# EAGLE design STUDENT V2 (EAGLE 8.2.2)

## Sheet 1 of 3
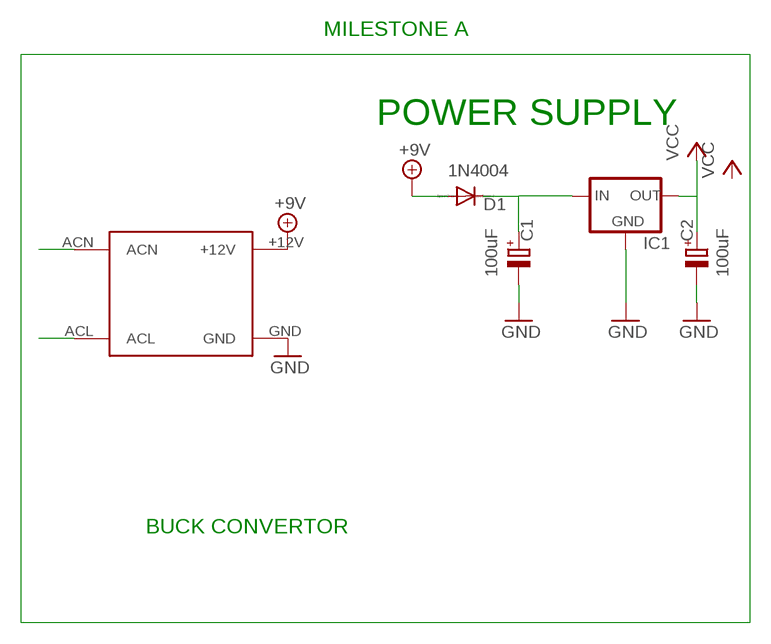
[diagram p0: schematic, sheet 1]

### Parts
C1  100uF  CPOL-EUE2.5-6  [E2,5-6]
C2  100uF  CPOL-EUE2.5-6  [E2,5-6]
D1  1N4004  [DO41-10]
IC1  78XXS  [78XXS]
U$2  12VMODULE12VMODULE  [12VMODULE]

### Nets
+9V: D1.A U$2.+12V ; also sheet 2
ACL: U$2.ACL ; also sheet 2
ACN: U$2.ACN ; also sheet 2
GND: C1.- C2.- IC1.GND U$2.GND ; also sheet 2,3
N$7: C1.+ D1.C IC1.IN
VCC: C2.+ IC1.OUT ; also sheet 2,3

### Notes on the sheet
- MILESTONE A
- POWER SUPPLY
- BUCK CONVERTOR

## Sheet 2 of 3
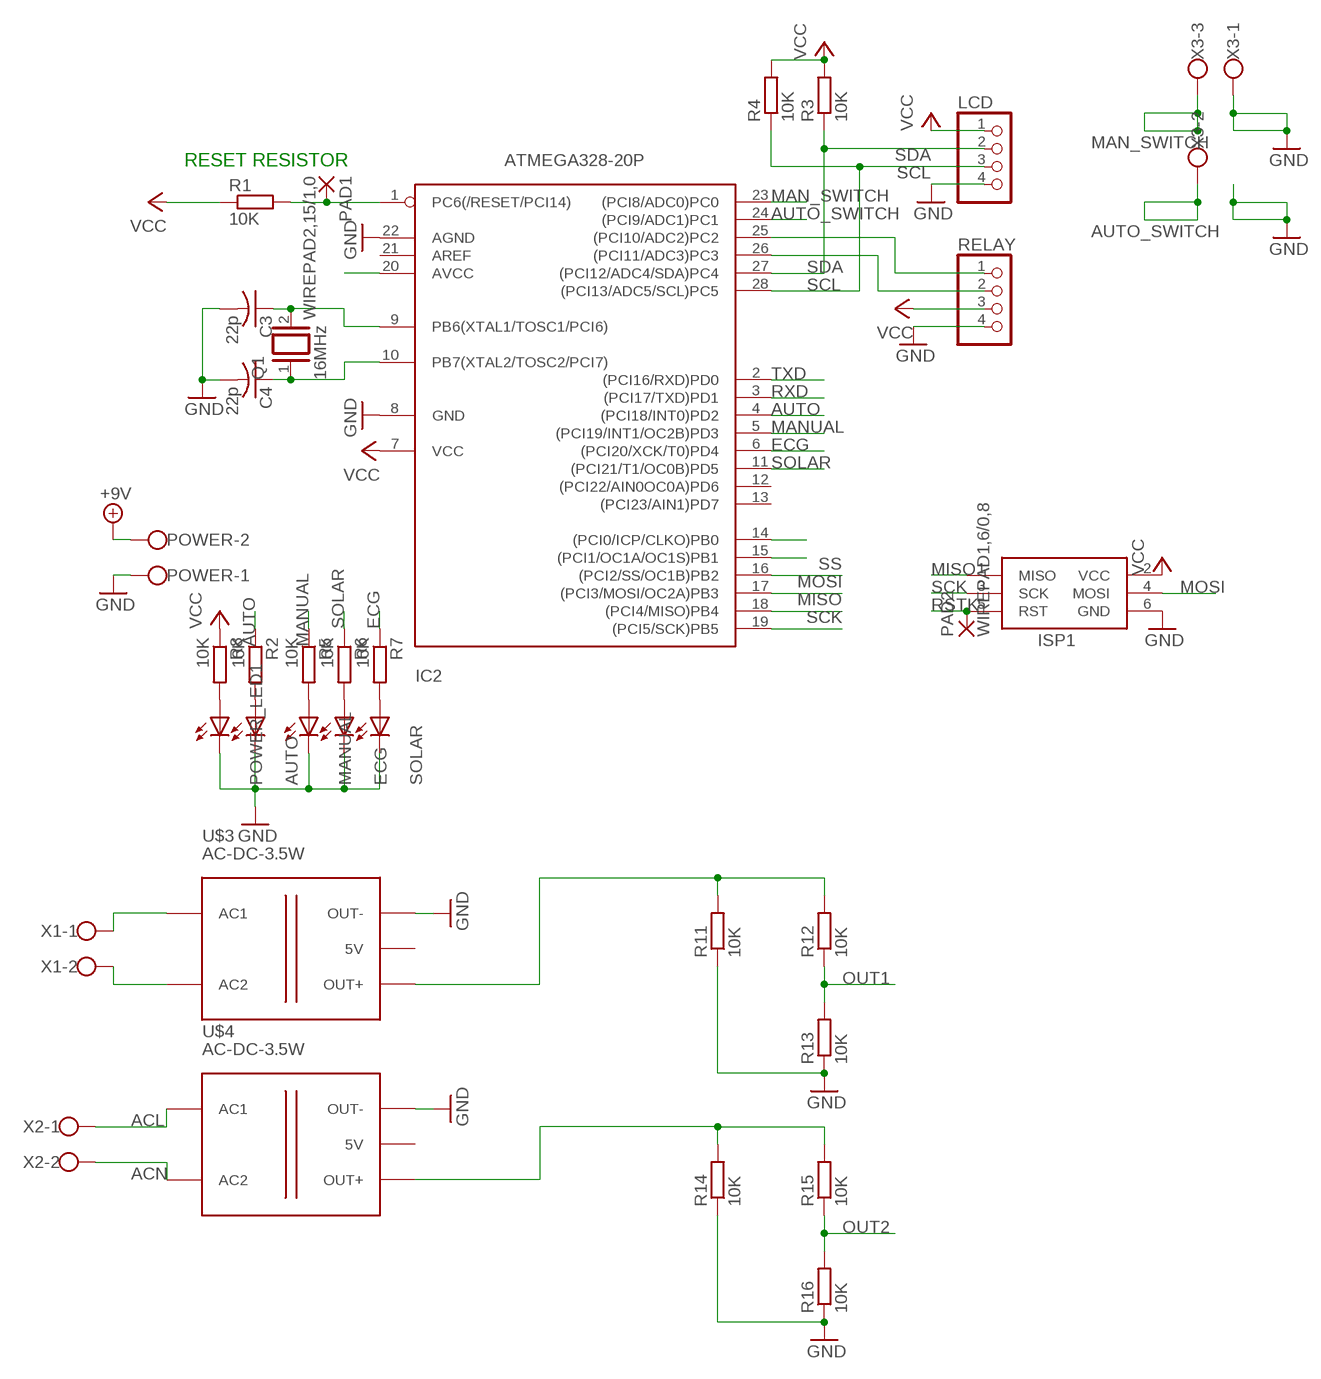
[diagram p1: schematic, sheet 2]

### Parts
AUTO  LED5MM  [LED5MM]
C3  22p  C-US025-024X044  [C025-024X044]
C4  22p  C-US025-024X044  [C025-024X044]
ECG  LED5MM  [LED5MM]
IC2  ATMEGA328-20P  [DIL28-3]
ISP1  AVRISP-6  [AVRISP]
LCD  PINHD-1X4  [1X04]
MANUAL  LED5MM  [LED5MM]
PAD1  WIREPAD2,15/1,0  [2,15/1,0]
PAD2  WIREPAD1,6/0,8  [1,6/0,8]
POWER  W237-102  [W237-102]
POWER_LED1  LED5MM  [LED5MM]
Q1  16MHz  XTAL/S  [QS]
R1  10K  R-EU_R2010  [R2010]
R2  10K  R-EU_R2010  [R2010]
R3  10K  R-EU_R2010  [R2010]
R4  10K  R-EU_R2010  [R2010]
R5  10K  R-EU_R2010  [R2010]
R6  10K  R-EU_R2010  [R2010]
R7  10K  R-EU_R2010  [R2010]
R8  10K  R-EU_R2010  [R2010]
R11  10K  R-EU_0207/12  [0207/12]
R12  10K  R-EU_0207/12  [0207/12]
R13  10K  R-EU_0207/12  [0207/12]
R14  10K  R-EU_0207/12  [0207/12]
R15  10K  R-EU_0207/12  [0207/12]
R16  10K  R-EU_0207/12  [0207/12]
RELAY  PINHD-1X4  [1X04]
SOLAR  LED5MM  [LED5MM]
U$3  AC-DC-3.5W  [AC-DC-3.5W]
U$4  AC-DC-3.5W  [AC-DC-3.5W]
X1  W237-102  [W237-102]
X2  W237-102  [W237-102]
X3  W237-103  [W237-103]

### Nets
+9V: POWER.2 ; also sheet 1
ACL: U$4.J1.1(AC1) X2.1 ; also sheet 1
ACN: U$4.J1.2(AC2) X2.2 ; also sheet 1
AUTO: IC2.4((PCI18/INT0)PD2) R2.1
AUTO_SWITCH: IC2.24((PCI9/ADC1)PC1) X3.2
ECG: IC2.6((PCI20/XCK/T0)PD4) R7.1
GND: AUTO.K(C) C3.2 C4.2 ECG.K(C) IC2.8(GND) IC2.22(AGND) ISP1.6(GND) LCD.4 MANUAL.K(C) POWER.1 POWER_LED1.K(C) R11.1 R13.1 R14.1 R16.1 RELAY.4 SOLAR.K(C) U$3.J2.1(OUT-) U$4.J2.1(OUT-) X3.1 ; also sheet 1,3
MAN_SWITCH: IC2.23((PCI8/ADC0)PC0) X3.3
MANUAL: IC2.5((PCI19/INT1/OC2B)PD3) R5.1
MISO: IC2.18((PCI4/MISO)PB4) ISP1.1(MISO)
MOSI: IC2.17((PCI3/MOSI/OC2A)PB3) ISP1.4(MOSI)
N$1: IC2.25((PCI10/ADC2)PC2) RELAY.1
N$2: POWER_LED1.A R8.2
N$4: C3.1 IC2.9(PB6(XTAL1/TOSC1/PCI6)) Q1.2
N$5: C4.1 IC2.10(PB7(XTAL2/TOSC2/PCI7)) Q1.1
N$6: AUTO.A R2.2
N$8: IC2.20(AVCC)
N$9: MANUAL.A R5.2
N$10: ECG.A R6.2
N$11: R7.2 SOLAR.A
N$12: R11.2 R12.2 U$3.J2.3(OUT+)
N$13: R14.2 R15.2 U$4.J2.3(OUT+)
N$14: U$3.J1.1(AC1) X1.1
N$15: U$3.J1.2(AC2) X1.2
N$18: IC2.26((PCI11/ADC3)PC3) RELAY.2
OUT1: IC2.14((PCI0/ICP/CLKO)PB0) R12.1 R13.2
OUT2: IC2.15((PCI1/OC1A/OC1S)PB1) R15.1 R16.2
RST: IC2.1(PC6(/RESET/PCI14)) PAD1.1(P) R1.2
RSTK: ISP1.5(RST) PAD2.1(P)
RXD: IC2.3((PCI17/TXD)PD1) ; also sheet 3
SCK: IC2.19((PCI5/SCK)PB5) ISP1.3(SCK)
SCL: IC2.28((PCI13/ADC5/SCL)PC5) LCD.3 R4.1
SDA: IC2.27((PCI12/ADC4/SDA)PC4) LCD.2 R3.1
SOLAR: IC2.11((PCI21/T1/OC0B)PD5) R6.1
SS: IC2.16((PCI2/SS/OC1B)PB2)
TXD: IC2.2((PCI16/RXD)PD0) ; also sheet 3
VCC: IC2.7(VCC) ISP1.2(VCC) LCD.1 R1.1 R3.2 R4.2 R8.1 RELAY.3 ; also sheet 1,3
Unconnected: IC2.12((PCI22/AIN0OC0A)PD6) IC2.13((PCI23/AIN1)PD7) IC2.21(AREF) U$3.J2.2(5V) U$4.J2.2(5V)

### Notes on the sheet
- RESET RESISTOR

## Sheet 3 of 3
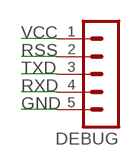
[diagram p2: schematic, sheet 3]

### Parts
DEBUG  MA05-1  [MA05-1]

### Nets
GND: DEBUG.5 ; also sheet 1,2
RSS: DEBUG.2
RXD: DEBUG.4 ; also sheet 2
TXD: DEBUG.3 ; also sheet 2
VCC: DEBUG.1 ; also sheet 1,2

## Library data of the parts
AUTO ECG MANUAL POWER_LED1 SOLAR = adafruit:LED: LED OSRAM: - CHIPLED LG R971, LG N971, LY N971, LG Q971, LY Q971, LO R971, LY R971 LH N974, LH R974 LS Q976, LO Q976, LY Q976 LO Q996 - Hyper CHIPLED LW Q18S LB Q993, LB Q99A, LB R99A - SideLED LS A670, LO A670, LY A670, LG A670, LP A670 LB A673, LV A673, LT A673, LW A673 LH A674 LY A675 LS A676, LA A676, LO A676, LY A676, LW A676 LS A679, LY A679, LG A679 - Hyper Micro SIDELED® LS Y876, LA Y876, LO Y876, LY Y876 LT Y87S - SmartLED LW L88C, LW L88S LB L89C, LB L89S, LG L890 LS L89K, LO L89K, LY L89K LS L896, LA L896, LO L896, LY L896 - TOPLED LS T670, LO T670, LY T670, LG T670, LP T670 LSG T670, LSP T670, LSY T670, LOP T670, LYG T670 LG T671, LOG T671, LSG T671 LB T673, LV T673, LT T673, LW T673 LH T674 LS T676, LA T676, LO T676, LY T676, LB T676, LH T676, LSB T676, LW T676 LB T67C, LV T67C, LT T67C, LS T67K, LO T67K, LY T67K, LW E67C LS E67B, LA E67B, LO E67B, LY E67B, LB E67C, LV E67C, LT E67C LW T67C LS T679, LY T679, LG T679 LS T770, LO T770, LY T770, LG T770, LP T770 LB T773, LV T773, LT T773, LW T773 LH T774 LS E675, LA E675, LY E675, LS T675 LS T776, LA T776, LO T776, LY T776, LB T776 LHGB T686 LT T68C, LB T68C - Hyper Mini TOPLED® LB M676 - Mini TOPLED Santana® LG M470 LS M47K, LO M47K, LY M47K Source: http://www.osram.convergy.de/
C1 C2 = resistor:CPOL-EU: POLARIZED CAPACITOR, European symbol
C3 C4 = adafruit:C-US: CAPACITOR, American symbol
D1 = diode:1N4004: DIODE general purpose rectifier, 1 A
DEBUG = con-lstb:MA05-1: PIN HEADER; OC_FARNELL: unknown; OC_NEWARK: unknown
IC1 = v-reg:78XXS: VOLTAGE REGULATOR
IC2 = atmega328:ATMEGA328*P: MICROCONTROLLER 32 kBytes FLASH 2 kBytes SRAM 1 kBytes EEPROM USART 8-channel 10 bit ADC
ISP1 = adafruit:AVRISP: AVR ISP HEADER Standard 6 pin header for AVR programming
LCD RELAY = pinhead:PINHD-1X4: PIN HEADER
PAD1 PAD2 = wirepad:WIREPAD: Wire PAD connect wire on PCB
POWER X1 X2 = con-wago-500:W237-102: WAGO SCREW CLAMP; MPN: 237-102; OC_FARNELL: unknown; OC_NEWARK: 70K9898
Q1 = special:XTAL/S: CRYSTAL
R1-R8 R11-R16 = resistor:R-EU_: RESISTOR, European symbol
U$2 = 12VMODULE:12VMODULE
U$3 U$4 = diy-modules:AC-DC-3.5W: AC/DC 3.5W Converter More details available here: https://www.itead.cc/wiki/AC-DC_Power_Module_5V_700mA Click here to find device on ebay.com <http://www.ebay.com/sch/ac+dc+3.5w+buck+step>
X3 = con-wago-500:W237-103: WAGO SCREW CLAMP; MPN: 237-103; OC_FARNELL: unknown; OC_NEWARK: 18M7116

## Board
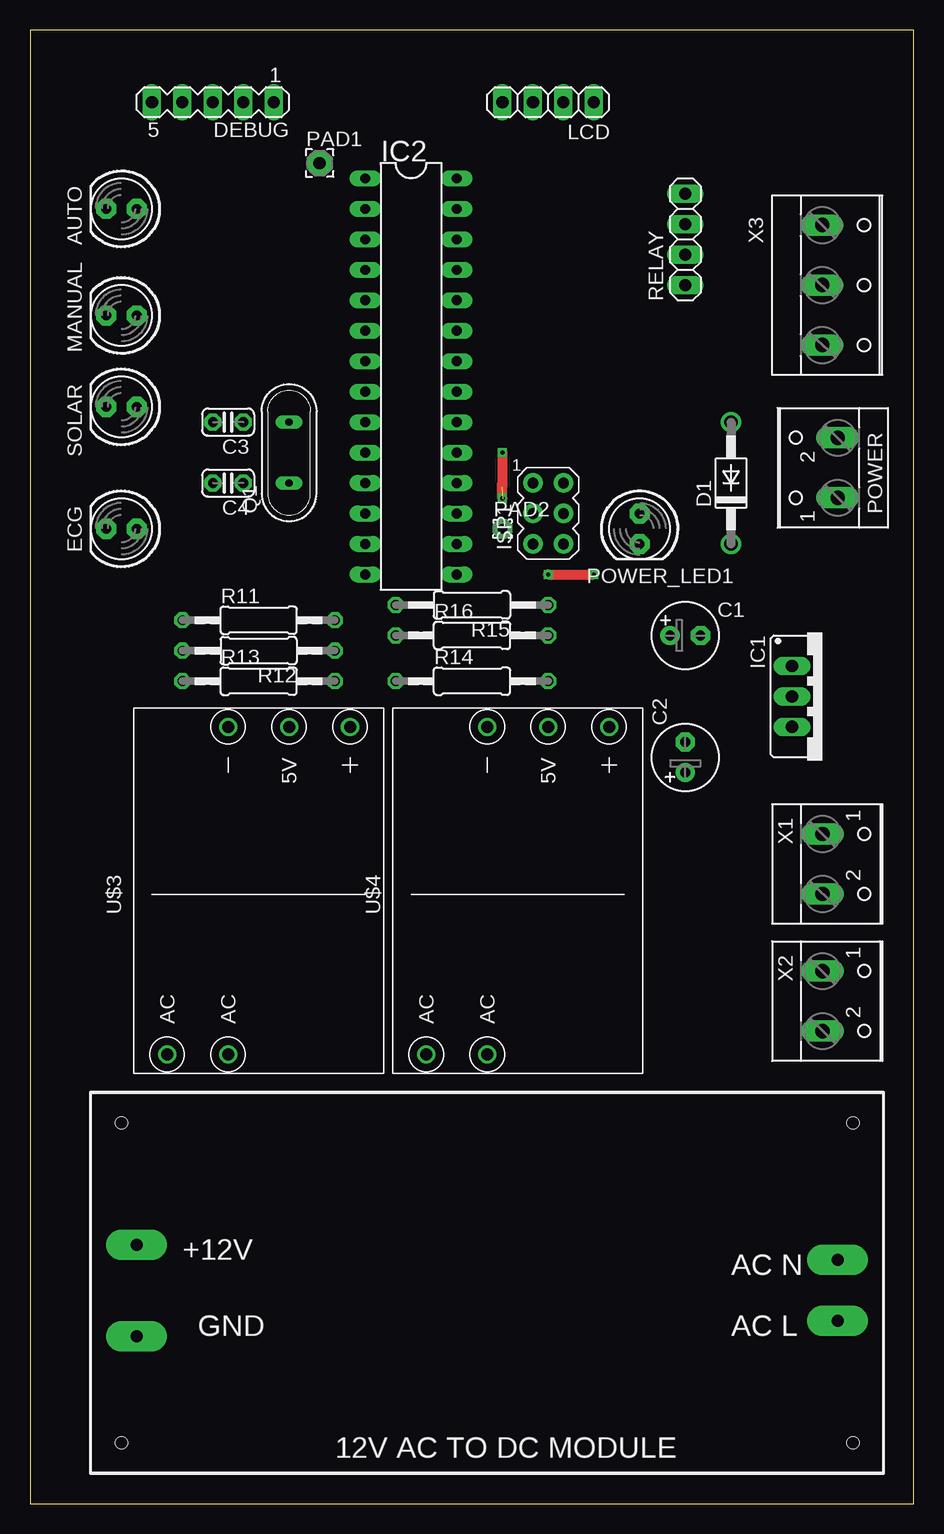
[diagram p3: board, top side]
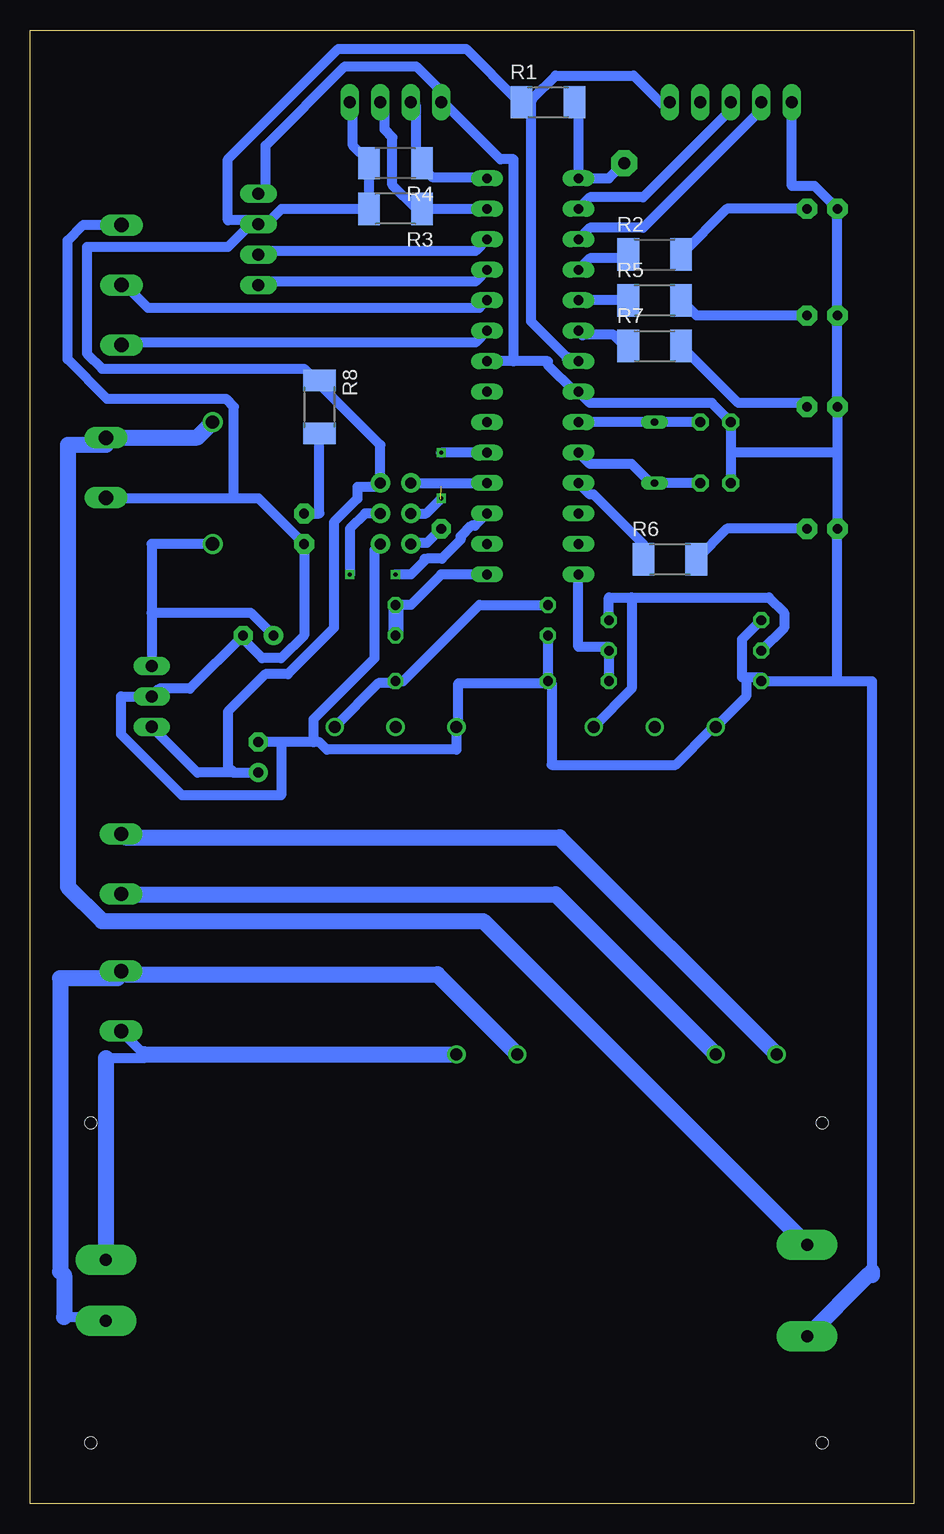
[diagram p4: board, bottom side, seen from below]

Size 73.64 x 122.86 mm. Coordinates in mm from the lower left corner, seen from the top.
Outline: 0,0 73.64,0 73.64,122.86 0,122.86 0,0
Copper layers (1*16): Top 0.035mm / dielectric 1.5mm / Bottom 0.035mm
Design rules "default *": minimum track width 52mil, minimum drill 24mil, track to track 20mil, track to pad 18mil, pad to pad 8mil, via to via 8mil, smd to smd 8mil, copper to edge 0mil, drill to drill 8mil, minimum pad ring 10mil, minimum via ring 8mil, stop-mask expansion 4mil, vias tented up to drill 0mil, thermal gap 10mil

### Footprints (pad centres in the part's own frame; a part is rotated, then mirrored left to right if it is on the bottom)
LED5MM = drill 0.813 pad 1.676 octagon: A -1.27,0; K 1.27,0
E2,5-6 = drill 0.813 pad 1.6: + -1.27,0 | drill 0.813 pad 1.6 octagon: - 1.27,0
C025-024X044 = drill 0.813 pad 1.422 octagon: 1 -1.27,0; 2 1.27,0
DO41-10 = drill 1.118: A 5.08,0; C -5.08,0
MA05-1 = drill 1.016 long: 1 -5.08,0; 2 -2.54,0; 3 0,0; 4 2.54,0; 5 5.08,0
78XXS = drill 1.016 long: GND 0,-2.54; IN -2.54,-2.54; OUT 2.54,-2.54
DIL28-3 = drill 0.813 long: 1 -16.51,-3.81; 2 -13.97,-3.81; 3 -11.43,-3.81; 4 -8.89,-3.81; 5 -6.35,-3.81; 6 -3.81,-3.81; 7 -1.27,-3.81; 8 1.27,-3.81; 9 3.81,-3.81; 10 6.35,-3.81; 11 8.89,-3.81; 12 11.43,-3.81; 13 13.97,-3.81; 14 16.51,-3.81; 15 16.51,3.81; 16 13.97,3.81; 17 11.43,3.81; 18 8.89,3.81; 19 6.35,3.81; 20 3.81,3.81; 21 1.27,3.81; 22 -1.27,3.81; 23 -3.81,3.81; 24 -6.35,3.81; 25 -8.89,3.81; 26 -11.43,3.81; 27 -13.97,3.81; 28 -16.51,3.81
AVRISP = drill 0.9 pad 1.626: 1 -1.27,2.54; 2 1.27,2.54; 3 -1.27,0; 4 1.27,0; 5 -1.27,-2.54; 6 1.27,-2.54
1X04 = drill 1.016 long: 1 -3.81,0; 2 -1.27,0; 3 1.27,0; 4 3.81,0
2,15/1,0 = drill 1.016 pad 2.159 octagon: 1 0,0
1,6/0,8 = drill 0.813 pad 1.6 octagon: 1 0,0
W237-102 = drill 1.194 long: 1 -2.5,-1.27; 2 2.5,-1.27
QS = drill 0.61 long: 1 -2.54,0; 2 2.54,0
R2010 = smd 1.8 x 2.7: 1 -2.2,0; 2 2.2,0
0207/12 = drill 0.813 octagon: 1 -6.35,0; 2 6.35,0
12VMODULE = drill 1 pad 2.54 long: +12V 33.02,-3.81; ACL -25.4,2.54; ACN -25.4,-2.54; GND 33.02,3.81 | hole 1: -26.67,12.7; -26.67,-13.97; 34.29,12.7; 34.29,-13.97
AC-DC-3.5W = drill 1: J1.1 -13.335,7.62; J1.2 -13.335,2.54; J2.1 13.97,2.54; J2.2 13.97,-2.54; J2.3 13.97,-7.62
W237-103 = drill 1.194 long: 1 -5,-1.29; 2 0,-1.29; 3 5,-1.29

### Placement (x,y rotation side)
AUTO  7.62,107.95 180 top
C1  54.61,72.39 0 top
C2  54.61,62.23 90 top
C3  16.51,90.17 180 top
C4  16.51,85.09 180 top
D1  58.42,85.09 90 top
DEBUG  15.24,116.84 180 top
ECG  7.62,81.28 180 top
IC1  66.04,67.31 270 top
IC2  31.75,93.98 270 top
ISP1  43.18,82.55 0 top
LCD  43.18,116.84 180 top
MANUAL  7.62,99.06 180 top
PAD1  24.13,111.76 0 top
PAD2  39.37,81.28 0 top
POWER  66.04,86.36 90 top
POWER_LED1  50.8,81.28 270 top
Q1  21.59,87.63 90 top
R1  30.48,116.84 0 bottom
R2  21.59,104.14 0 bottom
R3  43.18,107.95 180 bottom
R4  43.18,111.76 180 bottom
R5  21.59,100.33 0 bottom
R6  20.32,78.74 0 bottom
R7  21.59,96.52 0 bottom
R8  49.53,91.44 270 bottom
R11  19.05,73.66 0 top
R12  19.05,71.12 180 top
R13  19.05,68.58 0 top
R14  36.83,68.58 0 top
R15  36.83,74.93 180 top
R16  36.83,72.39 0 top
RELAY  54.61,105.41 90 top
SOLAR  7.62,91.44 180 top
U$2  41.91,17.78 180 top
U$3  19.05,50.8 90 top
U$4  40.64,50.8 90 top
X1  67.31,53.34 270 top
X2  67.31,41.91 270 top
X3  67.31,101.6 270 top

### Tracks (layer width: path | path; a pad name or v marks a point on that pad's centre or on a via)
+9V
  Bottom 0.813: 67.31,88.9 POWER.2
  Bottom 1.321: D1.A 59.69,88.9 66.99,88.9 POWER.2 67.31,88.27 70.48,88.27 70.48,51.44 67.63,48.58 35.88,48.58 U$2.+12V
ACL
  Bottom 0.813: 70.8,15.56 67.31,15.56 U$2.ACL | 66.04,44.13 X2.1
  Bottom 1.321: U$4.J1.1 39.69,44.13 65.72,44.13 X2.1 66.36,43.81 71.12,43.81 71.12,19.37 70.8,19.05 70.8,15.56
ACN
  Bottom 0.813: X2.2 66.04,39.37 64.13,37.46 64.13,37.15 67.31,37.15
  Bottom 1.321: 64.13,37.46 U$4.J1.2 | 67.31,37.15 U$2.ACN
AUTO
  Bottom 0.813: IC2.4 26.99,103.82 24.13,103.82 23.81,104.14 R2.1
AUTO_SWITCH
  Bottom 0.813: IC2.24 36.2,99.69 63.82,99.69 65.72,101.6 X3.2
ECG
  Bottom 0.813: 27.58,97.38 IC2.6 27.31,97.47 25.08,97.47 24.94,97.38 24.28,96.72 R7.1
GND
  Bottom 0.813: 15.24,87.63 C3.2 16.83,91.76 26.99,91.76 IC2.8 28.26,92.71 30.48,94.93 30.48,95.25 33.34,95.25 | 15.24,87.63 C4.2 | DEBUG.5 10.16,109.85 8.25,109.85 AUTO.K MANUAL.K SOLAR.K 6.35,87.63 | 6.35,87.63 ECG.K 6.35,68.58 | 6.35,87.63 15.24,87.63 | 56.64,83.82 67.31,83.82 POWER.1 | 56.64,83.82 54.61,83.82 POWER_LED1.K 50.8,72.39 52.7,70.48 54.29,70.48 55.88,72.07 C1.- 60.33,67.94 62.86,67.94 IC1.GND 66.04,67.31 66.04,64.13 60.96,59.05 52.7,59.05 52.7,63.5 | R11.1 14.29,72.07 14.29,68.9 13.97,68.9 | 13.97,68.9 12.7,68.9 R13.1 6.35,68.58 | 3.49,19.37 3.49,68.58 6.35,68.58 | 13.97,68.9 13.97,67.31 U$3.J2.1 16.83,64.61 19.84,61.59 30.16,61.59 30.16,68.42 R14.1 | 50.01,63.5 49.53,63.5 48.89,62.87 38.1,62.87 U$4.J2.1 37.94,65.09 37.94,68.42 30.8,68.42 R14.1 | 50.01,63.5 52.7,63.5 | RELAY.4 54,109.27 54,113.23 47.4,119.84 41.45,119.84 39.47,117.86 39.47,117.2 LCD.4 39.05,116.68 34.45,112.08 33.34,112.08 33.34,95.25 | 56.64,83.82 56.64,91.44 57.3,92.1 67.21,92.1 70.51,95.4 70.51,105.31 69.19,106.63 66.55,106.63 X3.1 | 33.34,95.25 IC2.22 | R16.1 R14.1 | ISP1.6 44.93,79.53 44.93,70.48 50.01,65.41 50.01,63.5 | 52.7,63.5 C2.-
  Bottom 1.321: U$2.GND 3.81,19.05 3.49,19.05 3.49,19.37
MAN_SWITCH
  Bottom 0.813: IC2.23 36.51,96.84 65.72,96.84 X3.3
MANUAL
  Bottom 0.813: R5.1 IC2.5
MISO
  Bottom 0.813: ISP1.1 IC2.18
MOSI  (via drill 0.35)
  Top 0.813: v43.18,77.47 v46.99,77.47
  Bottom 0.813: ISP1.4 45.72,82.55 46.99,81.28 v46.99,77.47 | 40.76,78.79 40.76,78.62 | 40.76,78.62 41.01,78.37 41.91,77.47 v43.18,77.47 | IC2.17 36.58,81.53 36.85,81.53 37.74,80.64 37.74,80.37 39.32,78.79 40.59,78.79 40.76,78.62
N$1
  Bottom 0.813: IC2.25 36.51,101.92 54.29,101.92 RELAY.1
N$2
  Bottom 0.813: R8.2 49.53,82.55 POWER_LED1.A
N$4
  Bottom 0.813: C3.1 Q1.2 IC2.9
N$5
  Bottom 0.813: C4.1 Q1.1 21.91,85.09 23.5,86.68 26.99,86.68 IC2.10
N$6
  Bottom 0.813: AUTO.A 15.56,107.95 19.37,104.14 R2.2
N$7
  Bottom 0.813: 63.5,74.3 63.5,80.01 D1.C | 63.5,74.3 IC1.IN | C1.+ 55.24,74.3 63.5,74.3
N$9
  Bottom 0.813: MANUAL.A 18.1,99.06 19.37,100.33 R5.2
N$10
  Bottom 0.813: ECG.A 15.56,81.28 18.1,78.74 R6.2
N$11
  Bottom 0.813: SOLAR.A 9.21,91.76 14.61,91.76 19.37,96.52 R7.2
N$12
  Bottom 0.813: R12.2 10.8,73.03 10.8,74.3 12.07,75.56 23.5,75.56 | 23.5,75.56 25.4,75.56 R11.2 | U$3.J2.3 23.5,67.94 23.5,75.56
N$13
  Bottom 0.813: R15.2 36.2,74.93 42.55,68.58 R14.2 43.5,68.42 44.61,68.42 U$4.J2.3
N$14
  Bottom 0.813: 66.04,55.56 X1.1
  Bottom 1.321: U$3.J1.1 29.53,55.56 65.72,55.56 X1.1
N$15
  Bottom 0.813: 66.04,50.8 X1.2
  Bottom 1.321: U$3.J1.2 29.85,50.8 65.72,50.8 X1.2
N$16  (via drill 0.35)
  Top 0.813: v39.37,83.82 39.37,85.09
N$18
  Bottom 0.813: IC2.26 36.51,104.46 54.29,104.46 RELAY.2
OUT1
  Bottom 0.813: R13.2 R12.1 25.4,71.44 27.94,71.44 IC2.14
OUT2
  Bottom 0.813: IC2.15 39.37,77.47 41.91,74.93 R15.1
  Bottom 1.27: R15.1 R16.2
RST
  Bottom 0.813: R1.2 27.94,116.84 IC2.1 25.4,110.49 PAD1.1
RSTK
  Bottom 0.813: ISP1.5 41.41,80.01 41.31,80.11 40.54,80.11 PAD2.1
RXD
  Bottom 0.813: IC2.3 26.99,106.36 22.54,106.36 12.7,116.21 DEBUG.4
SCK  (via drill 0.35)  (1 unrouted)
  Top 0.813: v39.37,87.63 39.37,84.81
  Bottom 0.813: IC2.19 v39.37,87.63 | ISP1.3 40.64,82.55 39.42,83.77
SCL
  Bottom 0.813: IC2.28 36.17,110.59 40.13,110.59 40.79,111.25 R4.1 41.45,111.91 41.45,116.53 LCD.3
SDA
  Bottom 0.813: IC2.27 R3.1 41.45,107.95 43.43,109.93 43.43,113.89 44.09,114.55 44.09,116.53 LCD.2
SOLAR
  Bottom 0.813: IC2.11 26.99,84.14 26.67,84.14 22.54,80.01 22.54,78.74 R6.1
TXD
  Bottom 0.813: IC2.2 26.99,108.9 22.54,108.9 15.24,116.21 DEBUG.3
VCC
  Bottom 0.813: IC1.OUT 59.69,60.96 56.67,60.96 | 56.67,60.96 C2.+ | 20.64,116.52 DEBUG.1 20.96,116.68 23.34,119.06 29.85,119.06 31.75,117.16 31.91,116.84 | RELAY.3 55.24,106.68 57.15,104.78 68.9,104.78 68.9,95.88 67.63,94.62 50.8,94.62 49.85,93.66 R8.1 49.53,93.34 44.45,88.27 ISP1.2 44.45,84.77 46.36,84.77 46.36,83.78 48.31,81.83 48.31,73.01 52.16,69.16 54.03,69.16 57.15,66.04 57.15,61.44 56.67,60.96 | 28.9,95.4 28.25,95.4 IC2.7 29.05,95.73 31.91,98.58 31.91,116.84 | 45.42,107.95 45.42,111.25 R4.2 45.42,111.91 46.74,113.23 46.74,116.53 LCD.1 | 45.42,107.95 52.68,107.95 54,106.63 RELAY.3 | 45.42,107.95 R3.2 | 31.91,116.84 R1.1 33.02,117 37.31,121.28 47.94,121.28 57.15,112.08 57.15,107 55.4,107 RELAY.3